# Altium schematic sheet PSU.SchDoc
size 420 x 297 mm
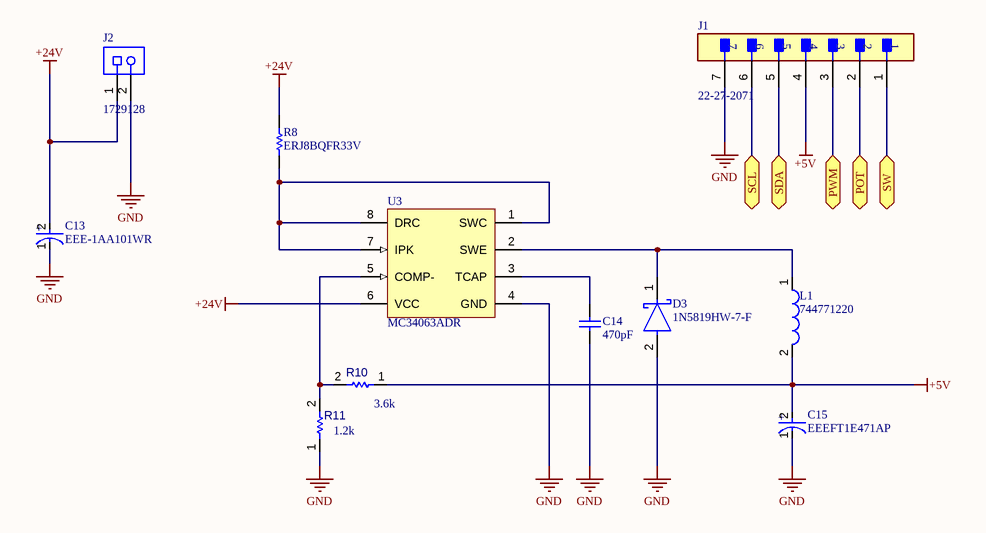
[diagram p0: PSU.SchDoc]

## Parts
C13  EEE-1AA101WR  [FP-SC-MFG]
C14  470pF  [CAPC1608X90X35NL10T15]
C15  EEEFT1E471AP  [FP-FTF-MFG]
D3  1N5819HW-7-F  [FP-SOD123-IPC_B]
J1  22-27-2071  [FP-22-27-2071-MFG]
J2  1729128  [PHOE-1729128-2_V]
L1  744771220  [WE-PD-L]
R8  ERJ8BQFR33V  [RESC3216X70X50NL05T20]
R10  3.6k  [RESC0402(1005)_L]
R11  1.2k  [RESC0402(1005)_L]
U3  MC34063ADR  [D0008A_M]

## Ports
POT (bidir), PWM (bidir), SCL (bidir), SDA (bidir), SW (bidir)

## Nets
+5V: C15.2(A) J1.4 L1.2 R10.1
+24V: C13.2(A) J2.1 R8.2 U3.6(VCC)
GND: C13.1(C) C14.1 C15.1(C) D3.2(A) J1.7 J2.2 R11.1 U3.4(GND)
POT: J1.2 ; port POT
PWM: J1.3 ; port PWM
SCL: J1.6 ; port SCL
SDA: J1.5 ; port SDA
SW: J1.1 ; port SW
NetC14_2: C14.2 U3.3(TCAP)
NetD3_1: D3.1(C) L1.1 U3.2(SWE)
NetR8_1: R8.1 U3.1(SWC) U3.7(IPK) U3.8(DRC)
NetR10_2: R10.2 R11.2 U3.5(COMP-)

## Notes on the sheet
- THIS DOCUMENT AND THE DATA DISCLOSED HEREIN OR
- HEREWITH IS THE PROPERTY OF ALTIUM LIMITED AND MAY
- DWG NO:
- REVISION
- REV:
- DESCRIPTION
- DATE
- APPROVED
- BE FREELY DISTRIBUTED IN WHOLE. NO RIGHTS ARE
- RESERVED OR EXPRESS OR IMPLIED WARANTEE GIVEN.
- ENG:
- APPROVALS
- PROJECT
- aiRCS Lab SAS
- 33400 Talence, Aquitaine, France
- 48 Rue Camille Pelletan
- DSN:
- CHK:
- REFERENCE DOCUMENTS
- PROJECT REVISION:
- TITLE
- DOCUMENT REVISION:
- DESIGN ITEM:
- BOM:
- FAB DWG:
- PCB DWG:
- ASSY DWG:
- SCALE:
- A3
- SIZE
- CAGE CODE
- FILE NAME
- DWG NO.
- SHEET
- OF
- REV
- (in symbol CMP-05427-000040-1) +
- (in symbol CMP-05427-000047-1) +

## Library data of the parts
C13 = CMP-05427-000047-1: CAP ALUM 100UF 20% 10V SMD; Life (Hours): 1000Hour; Ripple Current: 50mA; Packaging: Tape and Reel; Diameter: 5mm; Voltage Rating (DC): 10V; Mount: Surface Mount; Max Operating Temperature: 85°C; Length: 5.5mm; Case/Package: Radial; Height: 5.4mm; Construction: Cylindrical; Termination: SMD/SMT; Height - Seated (Max): 0.213inch; Series: S; Min Operating Temperature: -40°C; Capacitance: 100uF; Tolerance: 20%; Voltage Rating: 10V; Package Quantity: 1; Radiation Hardening: No; Ripple Current (AC): 50mA; Lead Free: Lead Free; RoHS Compliant: Yes; Contact Plating: Tin
C14 = CMP-2006-02921-1: Part Number: GRM188R71H471KA01D; Manufacturer: Murata
C15 = CMP-05427-000040-1: CAP ALUM 470UF 20% 25V SMD; ESR (Equivalent Series Resistance): 80mR; Dielectric Material: Aluminium; Lead Diameter: 0.9mm; Ripple Current: 850mA; Leakage Current: 117.5uA; Life (Hours): 2000Hour; Lead Free: Lead Free; Height - Seated (Max): 0.413inch; Contact Plating: Tin; Voltage: 25V; Package Quantity: 500; REACH SVHC: No SVHC; Diameter: 8mm; Features: General Purpose; Voltage Rating: 25V; Radiation Hardening: No; Number of Pins: 2; Length: 10.2mm; Max Operating Temperature: 105°C; Tolerance: 20%; Lead Pitch: 3.1mm; Voltage Rating (DC): 25V; Packaging: Tape and Reel; RoHS Compliant: Yes; Series: FT; Height: 10.2mm; Capacitance: 470uF; Construction: Cylindrical; Case/Package: Radial; Mount: Surface Mount; Termination: SMD/SMT; Min Operating Temperature: -55°C; Ripple Current (AC): 850mA
D3 = CMP-0303-00003-3: DIODE SCHOTTKY 40V 1A SOD123; Forward Voltage: 450mV; Capacitance: 110pF; Max Forward Surge Current (Ifsm): 25A; Peak Reverse Current: 50uA; Polarity: Standard; Element Configuration: Single; Max Power Dissipation: 450mW; Min Operating Temperature: -65°C; Package Quantity: 3000; Contact Plating: Tin; Weight: 0.000353oz; Max Repetitive Reverse Voltage (Vrrm): 40V; Max Reverse Voltage (DC): 40V; Height: 1.25mm; Average Rectified Current: 1A; Width: 1.7mm; Case/Package: SOD-123-2; Lead Free: Lead Free; Max Operating Temperature: 125°C; Current Rating: 1A; Termination: SMD/SMT; Forward Current: 1A; Radiation Hardening: No; Number of Pins: 2; Length: 2.85mm; Voltage Rating (DC): 40V; REACH SVHC: No SVHC; Peak Non-Repetitive Surge Current: 25A; Packaging: Tape and Reel; Output Current: 1A
J1 = CMP-04776-000328-1: CONN HEADER VERT 7POS 2.54MM; Contact Resistance: 10mR; Number of Positions: 7; Glow Wire Compliant: Non-compliant; Current Rating: 4A; Gender: Male; Connector Type: Male Pin; Voltage Rating: 250V; Insulation Resistance: 50GR; Number of Circuits: 7; Fastening Type: Friction; RoHS Compliant: Yes; Termination: Solder; Flammability Rating: UL94 V-0; Orientation: Straight; Packaging: Bulk; Housing Material: Nylon; Housing Color: White; Mount: Through Hole; Contact Plating: Tin; Package Quantity: 10; Depth: 5.8mm; Length: 5.08mm; Contact Material: Brass; Series: KK; Min Operating Temperature: 0°C; Contact Type: Male Pin; Max Current Rating: 4A; Contact Mating Length: 0.295inch; Number of Rows: 1; Color: Natural; Voltage Rating (DC): 250V; Max Voltage Rating (AC): 250V; Radiation Hardening: No; Height: 8.38mm; Max Operating Temperature: 75°C; Number of Contacts: 7; Pitch: 2.54mm; Lead Free: Lead Free; Halogen Free: Low Halogen
J2 = CMP-2000-05815-1: PCB Terminal Block, 13.5 A, 400 V, 2-Pin THD, RoHS, Bulk; Manufacturer: Phoenix Contact; Package Version: 03/2015; No. of Rows: 1; Pitch: 5.08mm; No. of Positions: 2; Voltage Rating: 400V; Current Rating: 13500mA; Manufacturer URL: http://www.phoenixcontact.com/; Datasheet URL: https://datasheet.ciiva.com/16046/1729128-16046181.pdf; RoHS: TRUE; Package URL: https://www.phoenixcontact.com/online/portal/pi/pxc/product_detail_page/!ut/p/b1/3VdJjqNKFDxLH8AFycySyWY2ozFsEPOMMQaDOX1XedGL_1Vdm5YXJleknhSKeBkvI6EA8ncAo3AYoDhBQGco6KN7VURTdemj9us_IEKEZo_YHiPAEWEFmDGOHMORkqKYCORBZxgL7ZoaZYcbFFUZ3fqxSY6GOuxydWUuHqz1ynmMFygu583Bob0Ewr6Sd_l-5m-kAueHiB0jpRwZwe58wwtkpxtMYd_LmGcDRU02dRNEyWt6Y2ti5pSyJ_reIkzIulrqApdnbT11V5jnCKbYNCvhEM1MCpPByat_X379-iThf08CI5GfOPqfBeS3BRoBOdD55AKVv0iLwCMq-2BrzXWSGRH7pUGD9uwXQjiph3xL0DKQwdGa0JImiIOmBNOestqgwTHSSs2oOep-78apyXQBvNi8ZLaFjvjWvcaUEBu0MC6Wbe-d6mB0FAebo2lUWinqYaZs5DAYzV0RP9yitUjnGJ0iI9xhZkT42OCQNUJJhkgWINNQLP2JFP6OpMg3JCVg70jqHT0lvKOnhHf0lPuOnnLf0VPuWx6_dxwUIvwk5WMkT0kLL1mh61l2yZVSzG3pYV_bqo-mj6uMKwKwdnnW8Jh5RTOJzMOA5c-eJDaZQw4mTMPH02PvS_ZAqNVjVTo2WyYLkwH_KU1mmmG5kjRhDqPXLwwVHvVOjCM60-fpXvTDfMGW1PVFVS1r4e4yVDk4ZdNbkUHvqPqQSeian4UD39fNKmachqdJ1NJbyk8rXT9mXTvPk3oE5meulKGgiruPJek-4I9hTT6G8ZLOyRSm2RRVbThERQad5OS28hdt4YW4vG0stgYYzsWsK4_7y6DZMjJSCqri1kyiZR5vD7pwIrNR7QwPHTcLTI5qT7eRlpHrdGiupYlqQDJ7zy_CND8fWWBoLRXxk1RVcXiBQwbTD4Xi7KL-FuO94t9xaqweXzH; PartNumber: 1729128; Package Description: 2-Pin Through Hole Device, Body 8.1 x 10.16 mm, Pitch 5.08 mm; Datasheet Version: 12/2013; Mounting Technology: ThroughHole; Orientation: Horizontal; Package Reference: 1729128-2; Packing: Bulk
L1 = CMP-0227-00735-1: SMD-Shielded Power Inductor WE-PD, L = 220 µH; Inductance: 220 ÂµH; PackageDescription: SMD Inductor, 2-Leads, Body 12.0 x 12.0 mm; PackageReference: WE-PD-L; ComponentLink1Description: Manufacturer Link; PackageVersion: 2006; ComponentLink2Description: Datasheet; ComponentLink2URL: http://www.we-online.de/katalog/media/pdf/744771220.pdf; ComponentLink1URL: http://www.we-online.com; DatasheetVersion: ver 6, Jun-2005
R8 = CMP-2003-00751-1: Manufacturer: Panasonic; Part Number: ERJ8BQFR33V
R10 = CMP-009-00062-5: 3.8k; Mounting Technology: SMT; Value: 3.6k; Pins: 2; Case/Package: 0402
R11 = CMP-009-00062-5: Mounting Technology: SMT; Value: 1.2k; Pins: 2; Case/Package: 0402
U3 = CMP-0323-00183-3: Buck Inverting Buck-Boost Regulator with 3 to 40 V Input and 1.55 to 40 V Output, 0 to 70 degC, 8-Pin SOIC (D), Green (RoHS & no Sb/Br); Manufacturer: Texas Instruments; Duty Cycle(Max)(%): 90; Rating: Catalog; Switch Current Limit(Typ)(A): 1.5; Iq(Typ)(mA): 4; Regulated Outputs(#): 1; Vin(Max)(V): 40; SubFamily: Step-Down Regulator; Topology: Buck, Inverting Buck-Boost; Vin(Min)(V): 3; Iout(Max)(A): 0.75; Vout(Min)(V): 1.55; Mounting Technology: Surface Mount; ComponentLink2Description: Package Specification; PackageDescription: 8-Pin Plastic Small Outline Integrated Circuit, 4.9 x 3.9 mm, Pitch 1.27 mm Pitch; PartNumber: MC34063ADR; ComponentLink3Description: URL Link1; DatasheetVersion: SLLS636M; ComponentLink1URL: http://www.ti.com/general/docs/lit/getliterature.tsp?genericPartNumber=MC34063A&fileType=pdf; Eco-Plan: Green (RoHS & no Sb/Br); Code_JEDEC: MS-012AA; ComponentLink2URL: http://www.ti.com/litv/pdf/msoi002j; ComponentLink3URL: Samples URL:http://www.ti.com/product/mc34063a#samples; PackageVersion: revM, Jun-2011; Vout(Max)(V): 40; PackageReference: D0008A; ComponentLink1Description: Datasheet